# EAGLE design 2HP2CV (EAGLE 6.6.0)

## Sheet 1 of 2
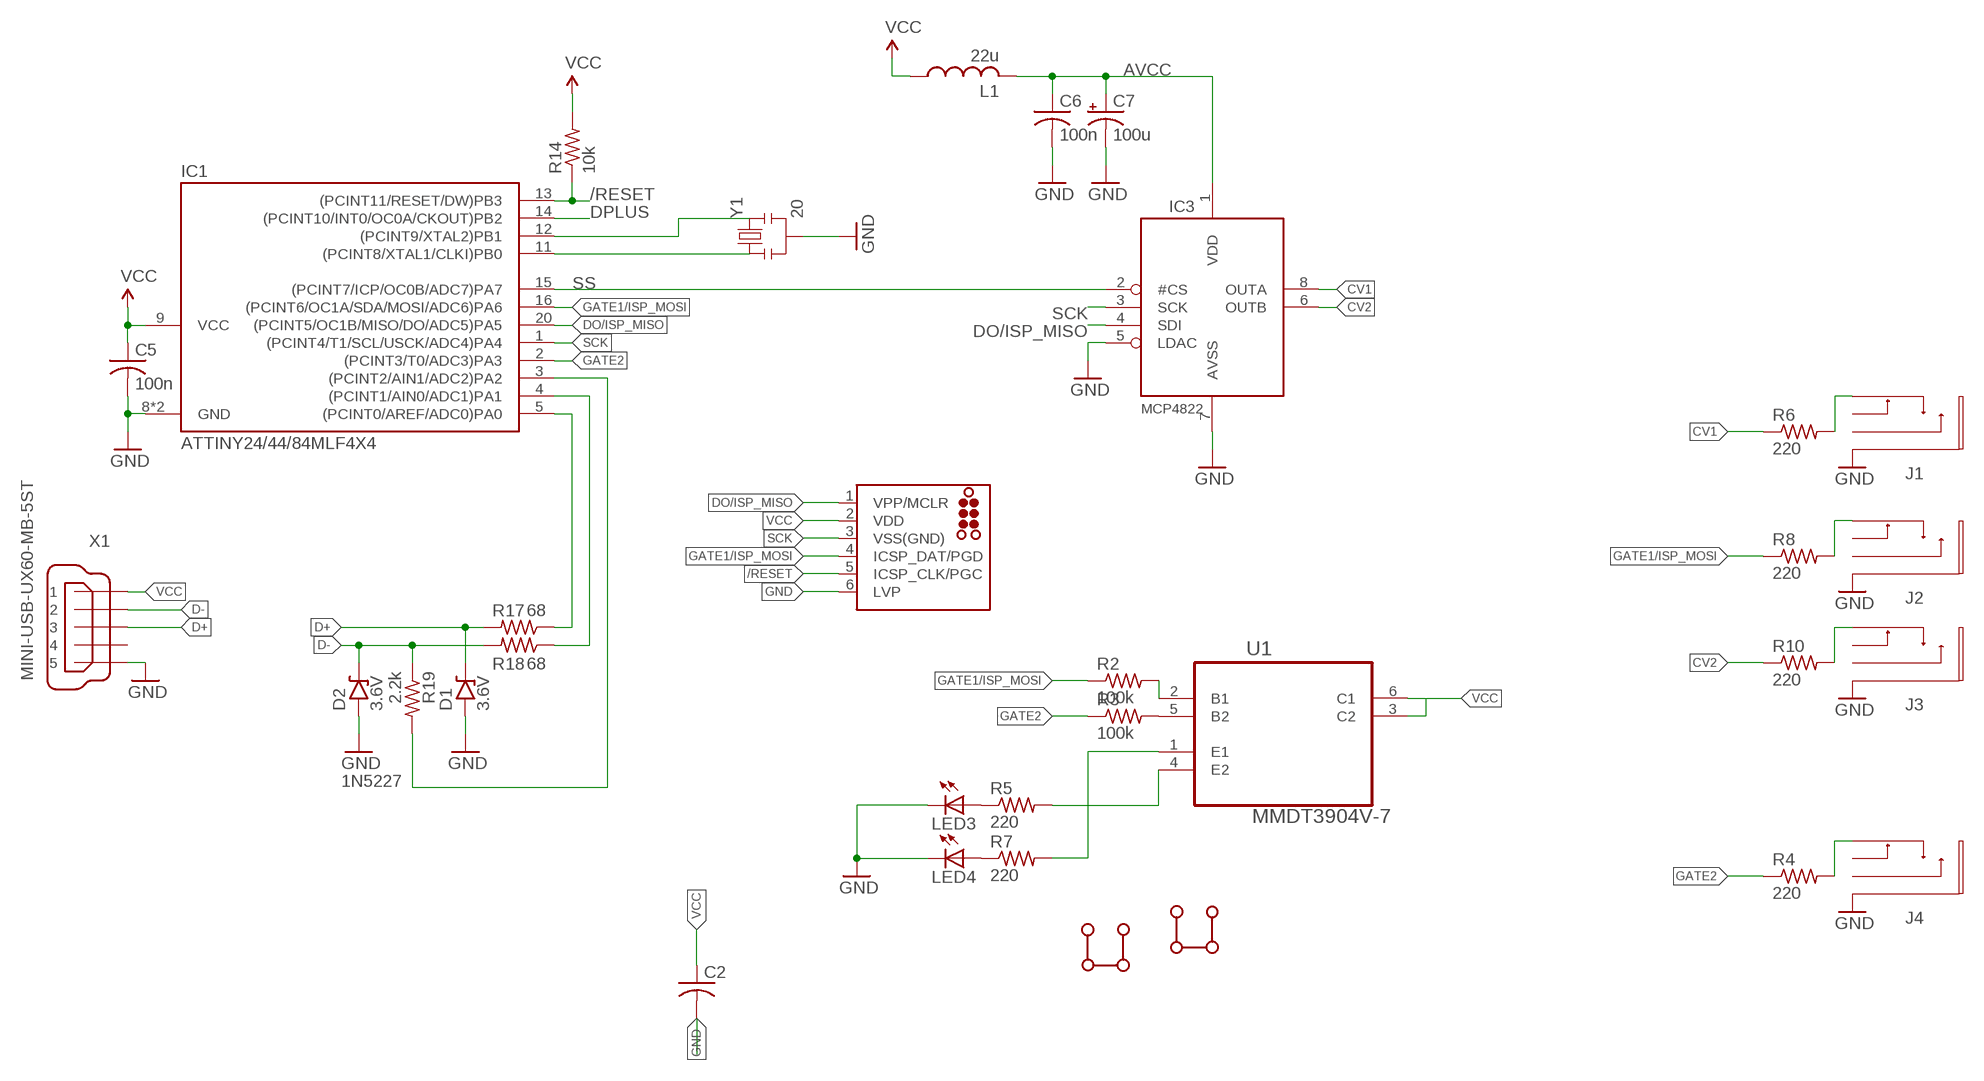
[diagram p0: schematic, sheet 1]

### Parts
C2  C-USC0805K  [C0805K]
C5  100n  C-USC0402  [C0402]
C6  100n  C-USC0402  [C0402]
C7  100u  CPOL-USA/3216-18R  [A/3216-18R]
D1  3.6V  1N47XXSOD323R  [SOD323-R]
D2  3.6V  1N47XXSOD323R  [SOD323-R]
IC1  ATTINY24/44/84MLF4X4  [MLF20-4X4]
IC3  MCP4822SO08  [SO08]
J1  PJ327E  [PJ327]
J2  PJ327E  [PJ327]
J3  PJ327E  [PJ327]
J4  PJ327E  [PJ327]
J5  TC2030-MCP-NL  [TC2030-MCP-NL]
L1  22u  L-USL2012C  [L2012C]
LED3  LED3MM  [LED3MM]
LED4  LED3MM  [LED3MM]
R2  100k  R-US_R0402  [R0402]
R3  100k  R-US_R0402  [R0402]
R4  220  R-US_R0402  [R0402]
R5  220  R-US_R0402  [R0402]
R6  220  R-US_R0402  [R0402]
R7  220  R-US_R0402  [R0402]
R8  220  R-US_R0402  [R0402]
R10  220  R-US_R0402  [R0402]
R14  10k  R-US_R0402  [R0402]
R17  68  R-US_R0402  [R0402]
R18  68  R-US_R0402  [R0402]
R19  2.2k  R-US_R0402  [R0402]
U1  MMDT3904V-7  [SOT50P170X60-6N]
U$5  PCB-69M3  [PCB-69M3]
U$6  PCB-69M3  [PCB-69M3]
X1  MINI-USB-UX60-MB-5ST  [UX60-MB-5ST]
Y1  20  RESONATOR16MHZ  [RESONATOR-SMD]

### Nets
/RESET: IC1.13((PCINT11/RESET/DW)PB3) J5.5(ICSP_CLK/PGC) R14.1
AVCC: C6.1 C7.+ IC3.1(VDD) L1.2
CV1: IC3.8(OUTA) R6.1
CV2: IC3.6(OUTB) R10.1
D+: D1.C R17.2 X1.3
D-: D2.C R18.2 R19.1 X1.2
DMINUS: IC1.4((PCINT1/AIN0/ADC1)PA1) R18.1
DO/ISP_MISO: IC1.20((PCINT5/OC1B/MISO/DO/ADC5)PA5) IC3.4(SDI) J5.1(VPP/MCLR)
DPLUS: IC1.5((PCINT0/AREF/ADC0)PA0) IC1.14((PCINT10/INT0/OC0A/CKOUT)PB2) R17.1
GATE1/ISP_MOSI: IC1.16((PCINT6/OC1A/SDA/MOSI/ADC6)PA6) J5.4(ICSP_DAT/PGD) R2.1 R8.1
GATE2: IC1.2((PCINT3/T0/ADC3)PA3) R3.1 R4.1
GND: C2.2 C5.2 C6.2 C7.- D1.A D2.A IC1.8(GND) IC1.TH(GND) IC3.5(LDAC) IC3.7(AVSS) J1.P$1 J2.P$1 J3.P$1 J4.P$1 J5.6(LVP) LED3.K(C) LED4.K(C) X1.5 Y1.2
N$1: R3.2 U1.5(B2)
N$2: R2.2 U1.2(B1)
N$3: J4.P$2 R4.2
N$4: J3.P$2 R10.2
N$5: R5.2 U1.4(E2)
N$6: R7.2 U1.1(E1)
N$7: LED3.A R5.1
N$8: J1.P$2 R6.2
N$9: LED4.A R7.1
N$13: J2.P$2 R8.2
N$23: IC1.12((PCINT9/XTAL2)PB1) Y1.3
N$24: IC1.11((PCINT8/XTAL1/CLKI)PB0) Y1.1
N$26: IC1.3((PCINT2/AIN1/ADC2)PA2) R19.2
SCK: IC1.1((PCINT4/T1/SCL/USCK/ADC4)PA4) IC3.3(SCK) J5.3(VSS(GND))
SS: IC1.15((PCINT7/ICP/OC0B/ADC7)PA7) IC3.2(#CS)
VCC: C2.1 C5.1 IC1.9(VCC) J5.2(VDD) L1.1 R14.2 U1.3(C2) U1.6(C1) X1.1
Unconnected: J1.P$3 J1.P$5 J2.P$3 J2.P$5 J3.P$3 J3.P$5 J4.P$3 J4.P$5 U$5.P$1 U$5.P$2 U$5.P$3 U$5.P$4 U$6.P$1 U$6.P$2 U$6.P$3 U$6.P$4 X1.4

### Notes on the sheet
- 1N5227

## Sheet 2 of 2

## Library data of the parts
C2 C5 C6 = rcl:C-US: CAPACITOR, American symbol
C7 = rcl:CPOL-US: POLARIZED CAPACITOR, American symbol
D1 D2 = og-diodes:1N47XX: Zener Diode 1N4728 - 1N4764: 3.3 V - 100V, 10% (1n47xxA 5%); DO-41 glass case
IC1 = 2HPCVpal:ATTINY24/44/84
IC3 = og-dac:MCP4822
J1-J4 = Raph's Lib:PJ327E
J5 = tag-connect:TC2030: TAG-CONNECT ICSP Connector Manufacturer: Tag-Connect <http://www.tag-connect.com> Cable for easy In-Circuit Serial Programming. Designed for Microchip ICD2, suitable for many others. Two variants - one "with legs" (for hands-free fit on PCB) and another "without legs" for quick programming. PAD Description 1 MCLR/Vpp 2 Vdd 3 GND 4 PGD (ISPDAT) 5 PGC (ISPCLK) 6 nc (used for LVP) ©2009 ROFA.cz - modified and updated by Robert Darlington ‹rdarlington@gmail.com›
L1 = rcl:L-US: INDUCTOR, American symbol
LED3 LED4 = library:LED: LED OSRAM: - CHIPLED LG R971, LG N971, LY N971, LG Q971, LY Q971, LO R971, LY R971 LH N974, LH R974 LS Q976, LO Q976, LY Q976 LO Q996 - Hyper CHIPLED LW Q18S LB Q993, LB Q99A, LB R99A - SideLED LS A670, LO A670, LY A670, LG A670, LP A670 LB A673, LV A673, LT A673, LW A673 LH A674 LY A675 LS A676, LA A676, LO A676, LY A676, LW A676 LS A679, LY A679, LG A679 - Hyper Micro SIDELED® LS Y876, LA Y876, LO Y876, LY Y876 LT Y87S - SmartLED LW L88C, LW L88S LB L89C, LB L89S, LG L890 LS L89K, LO L89K, LY L89K LS L896, LA L896, LO L896, LY L896 - TOPLED LS T670, LO T670, LY T670, LG T670, LP T670 LSG T670, LSP T670, LSY T670, LOP T670, LYG T670 LG T671, LOG T671, LSG T671 LB T673, LV T673, LT T673, LW T673 LH T674 LS T676, LA T676, LO T676, LY T676, LB T676, LH T676, LSB T676, LW T676 LB T67C, LV T67C, LT T67C, LS T67K, LO T67K, LY T67K, LW E67C LS E67B, LA E67B, LO E67B, LY E67B, LB E67C, LV E67C, LT E67C LW T67C LS T679, LY T679, LG T679 LS T770, LO T770, LY T770, LG T770, LP T770 LB T773, LV T773, LT T773, LW T773 LH T774 LS E675, LA E675, LY E675, LS T675 LS T776, LA T776, LO T776, LY T776, LB T776 LHGB T686 LT T68C, LB T68C - Hyper Mini TOPLED® LB M676 - Mini TOPLED Santana® LG M470 LS M47K, LO M47K, LY M47K Source: http://www.osram.convergy.de LUXEON: - LUMILED® LXK2-PW12-R00, LXK2-PW12-S00, LXK2-PW14-U00, LXK2-PW14-V00 LXK2-PM12-R00, LXK2-PM12-S00, LXK2-PM14-U00 LXK2-PE12-Q00, LXK2-PE12-R00, LXK2-PE12-S00, LXK2-PE14-T00, LXK2-PE14-U00 LXK2-PB12-K00, LXK2-PB12-L00, LXK2-PB12-M00, LXK2-PB14-N00, LXK2-PB14-P00, LXK2-PB14-Q00 LXK2-PR12-L00, LXK2-PR12-M00, LXK2-PR14-Q00, LXK2-PR14-R00 LXK2-PD12-Q00, LXK2-PD12-R00, LXK2-PD12-S00 LXK2-PH12-R00, LXK2-PH12-S00 LXK2-PL12-P00, LXK2-PL12-Q00, LXK2-PL12-R00 Source: www.luxeon.com KINGBRIGHT: KA-3528ASYC Source: www.kingbright.com
R2-R8 R10 = rcl:R-US_: RESISTOR, American symbol
R14 R17-R19 = resistor:R-US_: RESISTOR, American symbol
U1 = Diodes_Inc_By_element14_Batch_1:MMDT3904V-7: DUAL NPN SMALL SIGNAL SURFACE MOUNT TRANSISTOR; MPN: MMDT3904V-7; OC_FARNELL: 1773645; OC_NEWARK: 51R6829; PACKAGE: SOT-563-6; SUPPLIER: Diodes Inc
U$5 U$6 = Raph's Lib:PCB-69M3
X1 = con-hirose:MINI-USB-: MINI USB Connector Source: http://www.hirose.co.jp/cataloge_hp/e24000019.pdf; OC_FARNELL: unknown; OC_NEWARK: unknown
Y1 = SparkFun-FreqCtrl:RESONATOR: Resonator Small SMD resonator. Used, eg, on the Arduino Pro/ Pro Mini boards. 8MHz- XTAL-08895 16MHz- XTAL-08900; PROD_ID: XTAL-08900; VALUE: 16MHz

## Board
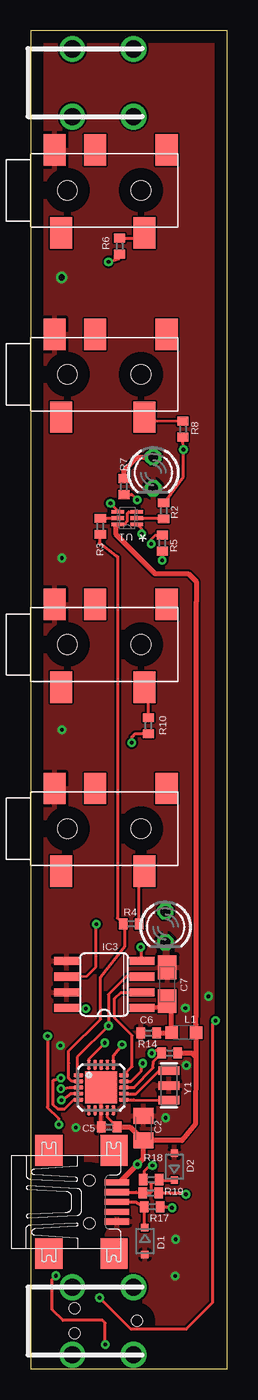
[diagram p1: board, top side]
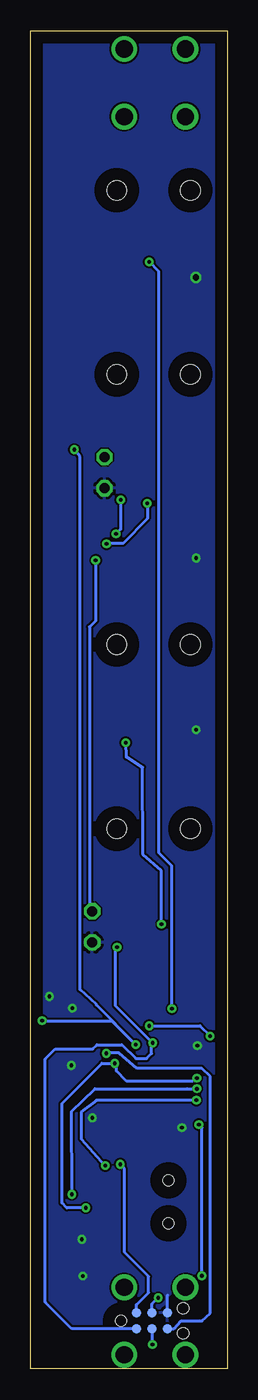
[diagram p2: board, bottom side, seen from below]

Size 16.03 x 109 mm. Coordinates in mm from the lower left corner, seen from the top.
Outline: 0,0 16.03,0 16.03,109 0,109 0,0
Copper layers (1*16): Top 0.035mm / dielectric 1.5mm / Bottom 0.035mm
Design rules "PCBway": minimum track width 6mil, minimum drill 0.2mm, track to track 0.15mm, track to pad 0.15mm, pad to pad 0.15mm, via to via 0.15mm, smd to smd 0.15mm, copper to edge 40mil, drill to drill 8mil, minimum pad ring 10mil, minimum via ring 8mil, stop-mask expansion 4mil, vias tented up to drill 25mil, thermal gap 10mil

### Footprints (pad centres in the part's own frame; a part is rotated, then mirrored left to right if it is on the bottom)
C0805K = smd 1.3 x 1.6: 1 -1,0; 2 1,0
C0402 = smd 0.7 x 0.9: 1 -0.65,0; 2 0.65,0
A/3216-18R = smd 1.95 x 1.5: + 1.375,0; - -1.375,0
SOD323-R = smd 0.6 x 0.6: A 1.1,0; C -1.1,0
MLF20-4X4 = smd 0.8 x 0.3: 1 -1.85,1; 2 -1.85,0.5; 3 -1.85,0; 4 -1.85,-0.5; 5 -1.85,-1; 11 1.85,-1; 12 1.85,-0.5; 13 1.85,0; 14 1.85,0.5; 15 1.85,1 | smd 0.3 x 0.8: 6 -1,-1.85; 7 -0.5,-1.85; 8 0,-1.85; 9 0.5,-1.85; 10 1,-1.85; 16 1,1.85; 17 0.5,1.85; 18 0,1.85; 19 -0.5,1.85; 20 -1,1.85 | smd 2.6 x 2.6: TH 0,0
SO08 = smd 0.66 x 2.032: 1 -1.905,-3.073; 2 -0.635,-3.073; 3 0.635,-3.073; 4 1.905,-3.073; 5 1.905,3.073; 6 0.635,3.073; 7 -0.635,3.073; 8 -1.905,3.073
PJ327 = smd 1.8 x 2.55: P$1 1.95,3.275; P$2 9.3,-3.475; P$3 5.25,3.275; P$4 2.5,-3.475; P$5 11.1,3.275 | hole 1.575: 3,0; 9,0
TC2030-MCP-NL = smd 0.787 x 0.787: 1 1.27,-0.635; 2 1.27,0.635; 3 2.54,-0.635; 4 2.54,0.635; 5 3.81,-0.635; 6 3.81,0.635 | hole 0.889: 0,0; 5.08,-1.016; 5.08,1.016
L2012C = smd 1 x 1: 1 -1,0; 2 1,0
LED3MM = drill 0.813 octagon: A -1.27,0; K 1.27,0
R0402 = smd 0.7 x 0.9: 1 -0.65,0; 2 0.65,0
SOT50P170X60-6N = smd 1.016 x 0.305: 1 -0.787,0.508; 2 -0.787,0; 3 -0.787,-0.508; 4 0.787,-0.508; 5 0.787,0; 6 0.787,0.508
PCB-69M3 = drill 1.4: P$1 0,2.75; P$2 0,-2.75; P$3 5,2.75; P$4 5,-2.75
UX60-MB-5ST = smd 2 x 0.5: 1 2.25,1.6; 2 2.25,0.8; 3 2.25,0; 4 2.25,-0.8; 5 2.25,-1.6 | smd 2.2 x 2.5: M1 -3.3,-4.2; M2 -3.3,4.2; M3 2,4.2; M4 2,-4.2 | hole 0.9: 0,-1.75; 0,1.75
RESONATOR-SMD = smd 0.7 x 1.7: 1 -1.2,0; 2 0,0; 3 1.2,0

### Placement (x,y rotation side)
C2  9.2,19.61 90 top
C5  6.4,19.71 180 top
C6  9.64,27.36 180 top
C7  11.15,31.33 270 top
D1  9.32,10.41 270 top
D2  11.73,16.47 90 top
IC1  5.75,22.92 0 top
IC3  6,31.31 90 top
J1  0,96 0 top
J2  0,81 0 top
J3  0,59 0 top
J4  0,44 0 top
J5  8.67,3.91 0 bottom
L1  12.5,27.39 180 top
LED3  11,36 270 top
LED4  10,73 270 top
R2  10.86,69.88 270 top
R3  5.68,68.64 90 top
R4  8.2,36.24 0 top
R5  10.74,67.26 90 top
R6  7.27,91.45 90 top
R7  7.61,71.86 270 top
R8  12.42,76.55 90 top
R10  9.6,52.37 90 top
R14  11.35,25.73 0 top
R17  9.91,13.2 180 top
R18  9.83,15.41 0 top
R19  9.81,14.32 0 top
U1  7.88,69.3 180 top
U$5  3.4,104.75 0 top
U$6  3.4,3.89 0 top
X1  4.79,13.59 0 top
Y1  11.27,23.08 90 top

### Tracks (layer width: path | path; a pad name or v marks a point on that pad's centre or on a via)
/RESET  (via drill 0.3)
  Top 0.254: IC1.13 8.43,22.92 10,24.52 10.01,25.04 R14.1 10.4,26.02 v9.87,25.7
  Bottom 0.254: J5.5 4.34,3.28 3.76,3.9 2.05,3.9 1.38,4.53 1.38,23.8 2.07,24.49 7.35,24.49 8.83,25.73 9.79,25.73 v9.87,25.7
AVCC
  Top 0.406: IC3.1 10.66,29.46 C7.+ 11.5,29.6 L1.2 11.47,27.36 C6.1
CV1  (via drill 0.3)
  Top 0.254: IC3.8 4.37,29.46 v4.51,29.33 | v6.35,90.17 7.22,90.44 R6.1
  Bottom 0.254: v4.51,29.33 4.51,40.97 5.57,42.02 5.57,89.39 v6.35,90.17
CV2  (via drill 0.3)
  Top 0.254: IC3.6 4.59,32.01 5.33,32.75 5.33,36.18 v5.36,36.21 | v8.26,51 8.26,51.47 8.53,51.73 9.58,51.73 R10.1
  Bottom 0.254: v5.36,36.21 5.36,40.59 6.87,41.91 6.89,49 8.21,49.83 v8.26,51
D+
  Top 0.254: X1.3 8.57,13.59 R17.2 9.26,11.6 D1.C
D-
  Top 0.254: X1.2 8.63,14.39 R19.1 9.18,14.3 9.75,14.3 9.8,14.35 9.8,15.06 9.91,15.16 10.46,15.16 R18.2 10.47,15.37 D2.C
  Top 0.406: X1.2
DMINUS  (via drill 0.3)
  Top 0.254: IC1.4 3.25,22.42 v2.51,21.89 | v9.94,16.54 9.69,16.54 9.25,16.11 9.25,15.49 R18.1
  Bottom 0.254: v2.51,21.89 10.66,21.89 11.9,20.93 11.9,18.72 v9.94,16.54
DO/ISP_MISO  (via drill 0.3)
  Top 0.254: IC1.20 4.75,25.25 v6.06,26.55 | v8.99,34.36 8.99,33.5 IC3.4
  Bottom 0.254: v8.99,34.36 9.12,34.23 9.12,29.57 6.1,26.55 v6.06,26.55 6.17,26.44 6.17,25.68 6.57,25.27 7.45,25.27 8.58,26.41 10.62,26.41 10.96,26.06 14.01,26.06 14.83,25.24 14.83,5.43 12.67,3.28 J5.1
DPLUS  (via drill 0.3)
  Top 0.254: R17.1 11.44,13.2 v11.53,13.11 | IC1.14 8.19,23.42 9.03,24.25 9.03,24.74 v9.15,24.87 | IC1.5 3.52,21.92 2.75,21.14 2.23,21.14 1.84,21.49 1.84,23.5 v2.48,23.69
  Bottom 0.254: v11.53,13.11 13.08,13.11 13.48,13.51 13.48,21.62 10.21,24.89 9.1,24.89 v9.15,24.87 9.03,24.74 9.03,24.25 8.2,23.43 3.46,23.43 2.86,23.43 v2.48,23.69
GATE1/ISP_MOSI  (via drill 0.3)
  Top 0.254: IC1.16 6.75,25.51 v7.46,26.4 | R8.1 12.46,74.75 v12.46,74.87 12.45,72.68 R2.1 | v5.63,5.78 8.16,3.25 12.72,3.25 14.87,5.4 14.87,28.1 v15.09,28.36
  Bottom 0.254: v12.46,74.87 12,74.29 12,30.89 10.67,29.69 10.67,29.64 7.46,26.42 v7.46,26.4 9.41,28.36 v15.09,28.36 | J5.4 6.13,5.28 v5.63,5.78
GATE2
  Top 0.254: R3.1 5.62,67.28 6.99,66.2 7.07,66.2 7.07,36.72 R4.1 7.69,36.2 7.7,34.43 5.68,31.92 5.71,28.48 3.1,25.91 3.11,24.89 3.11,23.66 3.36,23.42 IC1.2
GND  (via drill 0.3, 0.5)
  Top 0.254: IC1.TH IC1.8 C5.2
  Bottom 0.254: J5.6 4.86,5.99 4.87,6
  other vias: 2.54,52.07 2.54,66.04 2.54,88.9 11.84,10.55 2.42,26.32 11.78,7.56 3.69,19.64 11.01,20.45 12.71,24.72 12.62,29.37 14.51,30.34
  pour Top: 0,109.22 16.51,109.22 16.51,0 0,0
  pour Bottom: 0,109.22 16.51,109.22 16.51,0 0,0
N$1
  Top 0.254: R3.2 7.08,69.28 U1.5
N$2
  Top 0.254: U1.2 10.66,69.3 R2.2
N$3
  Top 0.254: R4.2 8.84,40.06 J4.P$2
N$4
  Top 0.254: R10.2 9.57,55.49 J3.P$2
N$5  (via drill 0.3)
  Top 0.254: U1.4 7.09,69.92 v6.51,70.51 | v9.84,67.22 9.84,67.58 10.17,67.91 R5.2
  Bottom 0.254: v6.51,70.51 6.51,69.28 8.48,67.23 8.72,67.23 v9.84,67.22
N$6  (via drill 0.3)
  Top 0.254: R7.2 8.25,71.21 v8.69,70.78 | v9.07,68.01 9.07,68.39 U1.1
  Bottom 0.254: v8.69,70.78 8.69,68.39 v9.07,68.01
N$7  (via drill 0.3)
  Top 0.254: R5.1 v10.74,65.87 v10.73,65.86
  Bottom 0.254: v10.73,65.86 10.73,60.93 11.22,60.43 11.22,37.49 LED3.A
N$8
  Top 0.254: R6.2 9.43,92.11 9.57,91.97 9.57,92.26 J1.P$2
N$9
  Top 0.406: R7.1 7.61,73.14 8.73,74.26 9.99,74.26 LED4.A
N$13
  Top 0.254: R8.2 9.23,77.15 9.09,77 9.09,77.31 J2.P$2
N$23
  Top 0.254: IC1.12 8.61,22.42 10.52,24.32 11.24,24.32 Y1.3
N$24
  Top 0.254: IC1.11 8.39,21.92 Y1.1
N$26  (via drill 0.3)
  Top 0.254: R19.2 12.52,14.32 v12.66,14.22 | v2.46,22.81 3.17,22.92 IC1.3
  Bottom 0.254: v12.66,14.22 12.69,20.96 10.79,22.82 3.27,22.81 v2.46,22.81
SCK  (via drill 0.3)
  Top 0.254: IC3.3 7.88,32.01 6.35,30.48 v6.35,27.94 3.81,25.4 3.81,24.01 IC1.1 | v6.09,1.97 6.09,3.74 5.88,3.95 2.63,3.95 1.77,4.82 1.77,7.29 v2.06,7.58 | v2.31,19.89 2.31,20.37 1.36,21.32 1.38,21.34 v1.38,27.11
  Bottom 0.254: J5.3 6.13,2.02 v6.09,1.97 | v2.06,7.58 2.06,19.64 v2.31,19.89 | v6.35,27.94 2.22,27.94 v1.38,27.11
SS
  Top 0.254: IC1.15 7.6,23.95 8.28,24.63 8.28,27.15 6.85,28.58 6.85,30.16 7.36,30.66 8.68,30.66 IC3.2
VCC  (via drill 0.3)
  Top 0.254: IC1.9 6.25,20.51 C5.1 | U1.6 7.6,68.79 7.9,69.09 7.9,69.67 8.02,69.79 8.66,69.79 U1.3
  Top 0.406: X1.1 7.25,15.19 v8.72,16.66 9.2,17.14 C2.1 | C2.1 | C5.1 8.1,19.71 C2.1 | 13.48,25.4 L1.1 13.5,28.05 13.51,29.1 13.51,62.44 13.5,62.44 13.5,64.13 12.86,64.77 10.16,64.77 6.93,68 6.93,68.62 U1.6 | 13.48,25.4 13.44,19.97 12.34,18.6 C2.1 | R14.2 13.16,25.73 13.48,25.4
  Bottom 0.254: J5.2 7.4,5.22 6.41,6.21 6.41,7.53 8.38,9.5 8.38,16.32 v8.72,16.66

### Text on the board
bDocu: Orignial Design By E Gillet / CC BY-SA 3.0 | 2HP2CV / MiSW 2020